# EAGLE schematic Frequency Counter v2 (EAGLE 9.1.2)
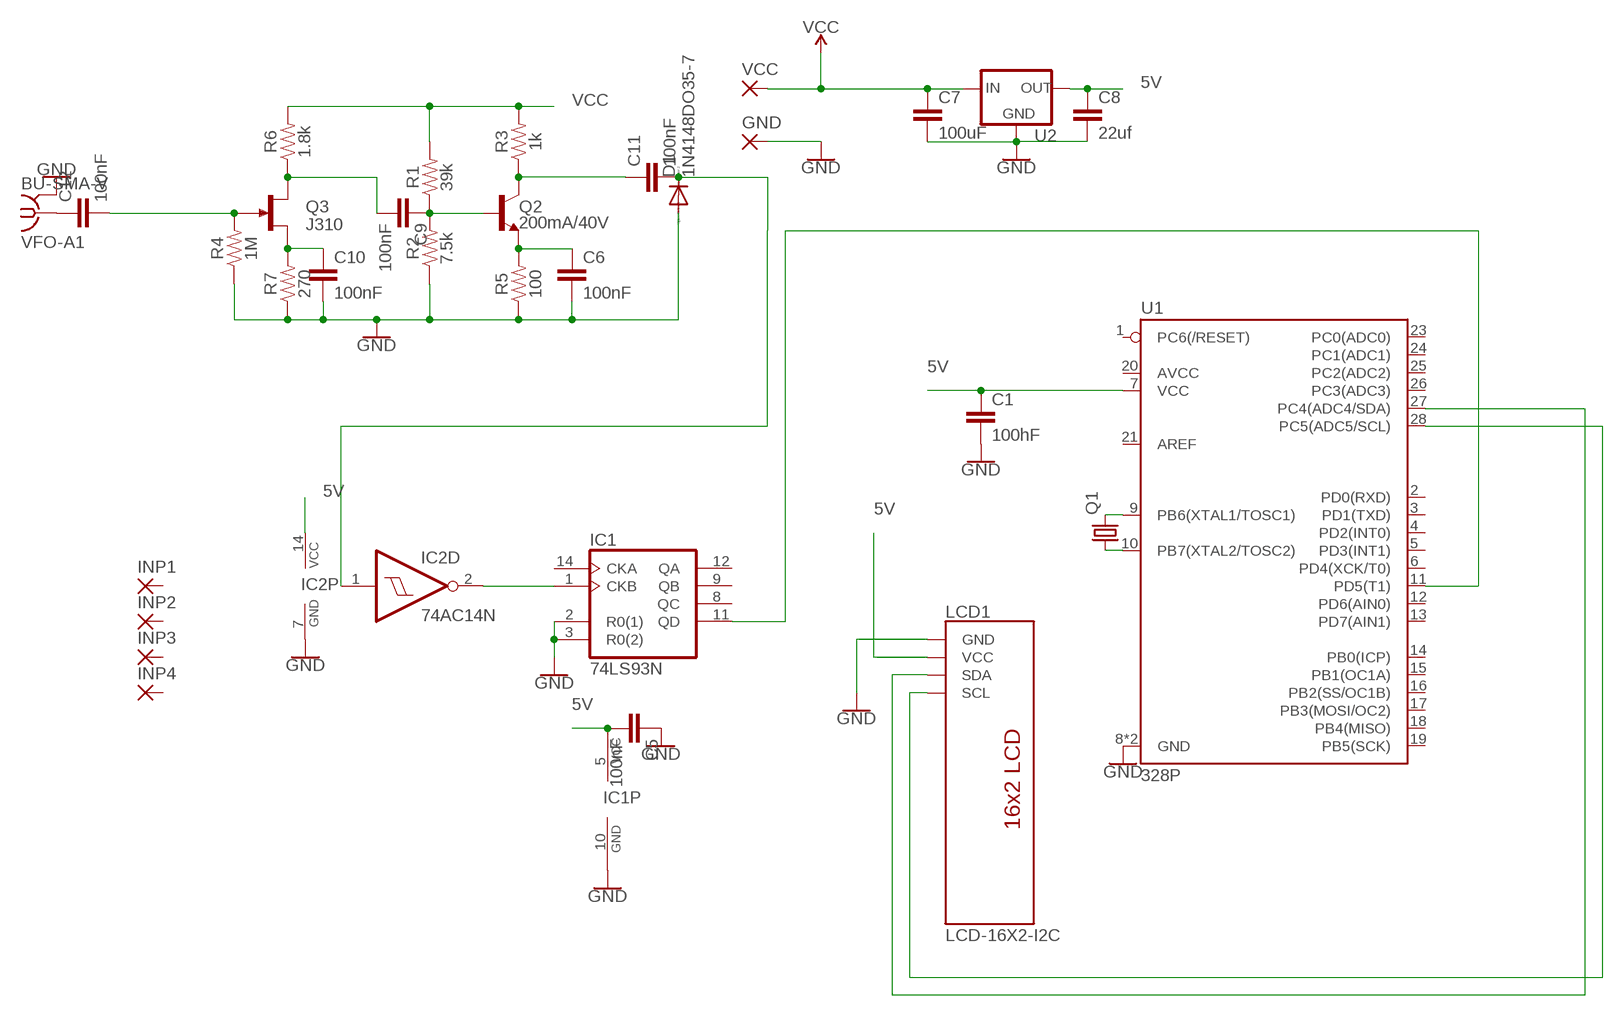
[diagram p0: schematic, sheet 1]

## Parts
C1  100hF  C5/3.5  [C5B3.5]
C5  100nF  C5/3.5  [C5B3.5]
C6  100nF  C5/3.5  [C5B3.5]
C7  100uF  C5/3.5  [C5B3.5]
C8  22uf  C5/3.5  [C5B3.5]
C9  100nF  C5/3.5  [C5B3.5]
C10  100nF  C5/3.5  [C5B3.5]
C11  100nF  C5/3.5  [C5B3.5]
C12  100nF  C5/3.5  [C5B3.5]
D1  1N4148DO35-7  [DO35-7]
GND  3,17/1,1  [3,17/1,1]
IC1  74LS93N  [DIL14]
IC2  74AC14N  [DIL14]
INP1  3,17/1,1  [3,17/1,1]
INP2  3,17/1,1  [3,17/1,1]
INP3  3,17/1,1  [3,17/1,1]
INP4  3,17/1,1  [3,17/1,1]
LCD1  LCD-16X2-I2C  [LCD-16X2-I2C]
Q1  CRYTALHC49S  [HC49/S]
Q2  200mA/40V  TRANS_NPN-2N3904  [TO-92]
Q3  J310  [TO92R]
R1  39k  10KOHM-HORIZ-1/4W-1%  [AXIAL-0.3]
R2  7.5k  10KOHM-HORIZ-1/4W-1%  [AXIAL-0.3]
R3  1k  10KOHM-HORIZ-1/4W-1%  [AXIAL-0.3]
R4  1M  10KOHM-HORIZ-1/4W-1%  [AXIAL-0.3]
R5  100  10KOHM-HORIZ-1/4W-1%  [AXIAL-0.3]
R6  1.8k  10KOHM-HORIZ-1/4W-1%  [AXIAL-0.3]
R7  270  10KOHM-HORIZ-1/4W-1%  [AXIAL-0.3]
U1  328P  ATMEGA328P_PDIP  [DIP28]
U2  V_REG_78XXSINK  [TO220-IGO]
VCC  3,17/1,1  [3,17/1,1]
VFO-A1  BU-SMA-V  [BU-SMA-V]

## Nets
5V: C1.1 C5.2 C8.1 IC1.5(VCC) IC2.14(P:VCC) LCD1.2(VCC) U1.7(VCC) U2.OUT
GND: C1.2 C5.1 C6.2 C7.2 C8.2 C10.2 D1.A GND.1(P) IC1.2(R0(1)) IC1.3(R0(2)) IC1.10(GND) IC2.7(P:GND) LCD1.1(GND) R2.P$1 R4.P$1 R5.P$1 R7.P$1 U1.8(GND) U1.22(GND) U2.GND VFO-A1.2 VFO-A1.3 VFO-A1.4 VFO-A1.5
N$1: C12.1 VFO-A1.1
N$2: Q1.2 U1.9(PB6(XTAL1/TOSC1))
N$3: Q1.1 U1.10(PB7(XTAL2/TOSC2))
N$5: LCD1.3(SDA) U1.27(PC4(ADC4/SDA))
N$6: LCD1.4(SCL) U1.28(PC5(ADC5/SCL))
N$7: C12.2 Q3.G R4.P$2
N$8: C9.1 Q2.2(B) R1.P$1 R2.P$2
N$9: C9.2 Q3.D R6.P$1
N$10: C10.1 Q3.S R7.P$2
N$11: C11.2 D1.C IC2.1(D:I)
N$12: C6.1 Q2.1(E) R5.P$2
N$13: C11.1 Q2.3(C) R3.P$1
N$14: IC1.1(CKB) IC2.2(D:O)
N$15: IC1.11(QD) U1.11(PD5(T1))
VCC: C7.1 R1.P$2 R3.P$2 R6.P$2 U2.IN VCC.1(P)
Unconnected: IC1.8(QC) IC1.9(QB) IC1.12(QA) IC1.14(CKA) IC2.3(E:I) IC2.4(E:O) IC2.5(F:I) IC2.6(F:O) IC2.8(C:O) IC2.9(C:I) IC2.10(B:O) IC2.11(B:I) IC2.12(A:O) IC2.13(A:I) INP1.1(P) INP2.1(P) INP3.1(P) INP4.1(P) U1.1(PC6(/RESET)) U1.2(PD0(RXD)) U1.3(PD1(TXD)) U1.4(PD2(INT0)) U1.5(PD3(INT1)) U1.6(PD4(XCK/T0)) U1.12(PD6(AIN0)) U1.13(PD7(AIN1)) U1.14(PB0(ICP)) U1.15(PB1(OC1A)) U1.16(PB2(SS/OC1B)) U1.17(PB3(MOSI/OC2)) U1.18(PB4(MISO)) U1.19(PB5(SCK)) U1.20(AVCC) U1.21(AREF) U1.23(PC0(ADC0)) U1.24(PC1(ADC1)) U1.25(PC2(ADC2)) U1.26(PC3(ADC3))

## Library data of the parts
C1 C5-C12 = capacitor-wima:C: CAPACITOR naming: grid - package width
D1 = diode:1N4148: DIODE high speed (Philips)
GND INP1-INP4 VCC = wirepad:3,17/1,1: THROUGH-HOLE PAD
IC1 = 74xx-us:74*93: Decade, divide by twelve and binary COUNTER
IC2 = 74xx-eu:74*14: Hex schmitt trigger INVERTER
LCD1 = SparkFun-Displays:LCD-16X2-I2C: Standard text-only 16x2 parallel input LCD Basic 16 character by 2 line display. Typically utilizes the extremely common HD44780 parallel interface chipset SparkFun Products: Basic 16x2 Green <https://www.sparkfun.com/products/255> Basic 8x2 Green <https://www.sparkfun.com/products/11122>
Q1 = crystal:CRYTAL: CRYSTAL
Q2 = SparkFun-DiscreteSemi:TRANS_NPN: NPN transistor Current controlled devices typically used to amplify current or used as a switch. BC547 - COM-08928 <http://www.sparkfun.com/products/8928> (TO-92 45V 100mA) (1.Collector 2.Base 3.Emitter) 2N3904 - COM-00521 <http://www.sparkfun.com/products/521> (TO-92 40V 200mA) (1.Emitter 2.Base 3.Collector) P2N2222A - COM-12852 <http://www.sparkfun.com/products/12852> (TO-92 40V 600mA) (1.Collector 2.Base 3.Emitter); PROD_ID: TRANS-08447
Q3 = transistor-small-signal:J310: N-Channel RF Amplifier J309, J310 Source: http://www.fairchildsemi.com/pf/J3/J310.html
R1-R7 = SparkFun-Resistors:10KOHM: 10kΩ resistor A resistor is a passive two-terminal electrical component that implements electrical resistance as a circuit element. Resistors act to reduce current flow, and, at the same time, act to lower voltage levels within circuits. - Wikipedia; PROD_ID: RES-12183; VALUE: 10k
U1 = SparkFun-IC-Microcontroller:ATMEGA328P_PDIP: Atmel 328P Through hole ATMEGA328P uC used in the Arduino 32kb flash, 1k EEPROM, 2k SRAM Datasheet <http://www.sparkfun.com/datasheets/Components/SMD/ATMega328.pdf> SparkFun Products Storefront component: AVR 28 Pin 20MHz 32K 6A/D - ATMega328P <https://www.sparkfun.com/products/9061> (COM-09061) SparkFun Simon Says - Through-Hole Soldering Kit <https://www.sparkfun.com/products/10547> (KIT-10547) SparkFun Learn to Solder - Simon Says <https://www.sparkfun.com/products/13708> (KIT-13708) SparkFun BigTime Watch Kit <https://www.sparkfun.com/products/11734> (KIT-11734) SparkFun ClockIt <https://www.sparkfun.com/products/10930> (KIT-10930) SparkFun Serial Enabled LCD Kit <https://www.sparkfun.com/products/10097> (LCD-10097) SparkFun Simon Tilts - Through Hole Soldering Kit <https://www.sparkfun.com/products/12634> (KIT-12634) SparkFun Frequency Counter Kit <https://www.sparkfun.com/products/10140> (KIT-10140) FabFM Radio Kit <https://www.sparkfun.com/products/11043> (KIT-11043) SparkFun Binary Blaster Kit <https://www.sparkfun.com/products/12037> (KIT-12037) SparkFun Metro-Gnome <https://www.sparkfun.com/products/9236> (KIT-09236) ATmega328 with Arduino Optiboot (Uno) <https://www.sparkfun.com/products/10524> (DEV-10524); PROD_ID: IC-09136
U2 = SparkFun-IC-Power:V_REG_78XX: Voltage Regulator Standard 78xx regulator. IGO (Input Ground Output). Spark Fun Electronics SKU : COM-00107
VFO-A1 = con-coax:BU-SMA-V: FEMALE SMA CONNECTOR Radiall distributor RS 112-3794; OC_FARNELL: unknown; OC_NEWARK: unknown

## Net classes
0 default: width 0.254 mm, drill 0.254 mm, clearance 0.254 mm